# Altium schematic sheet 6V_Supply.SchDoc
size 297 x 209 mm; SheetNumber: 6; SheetTotal: 11
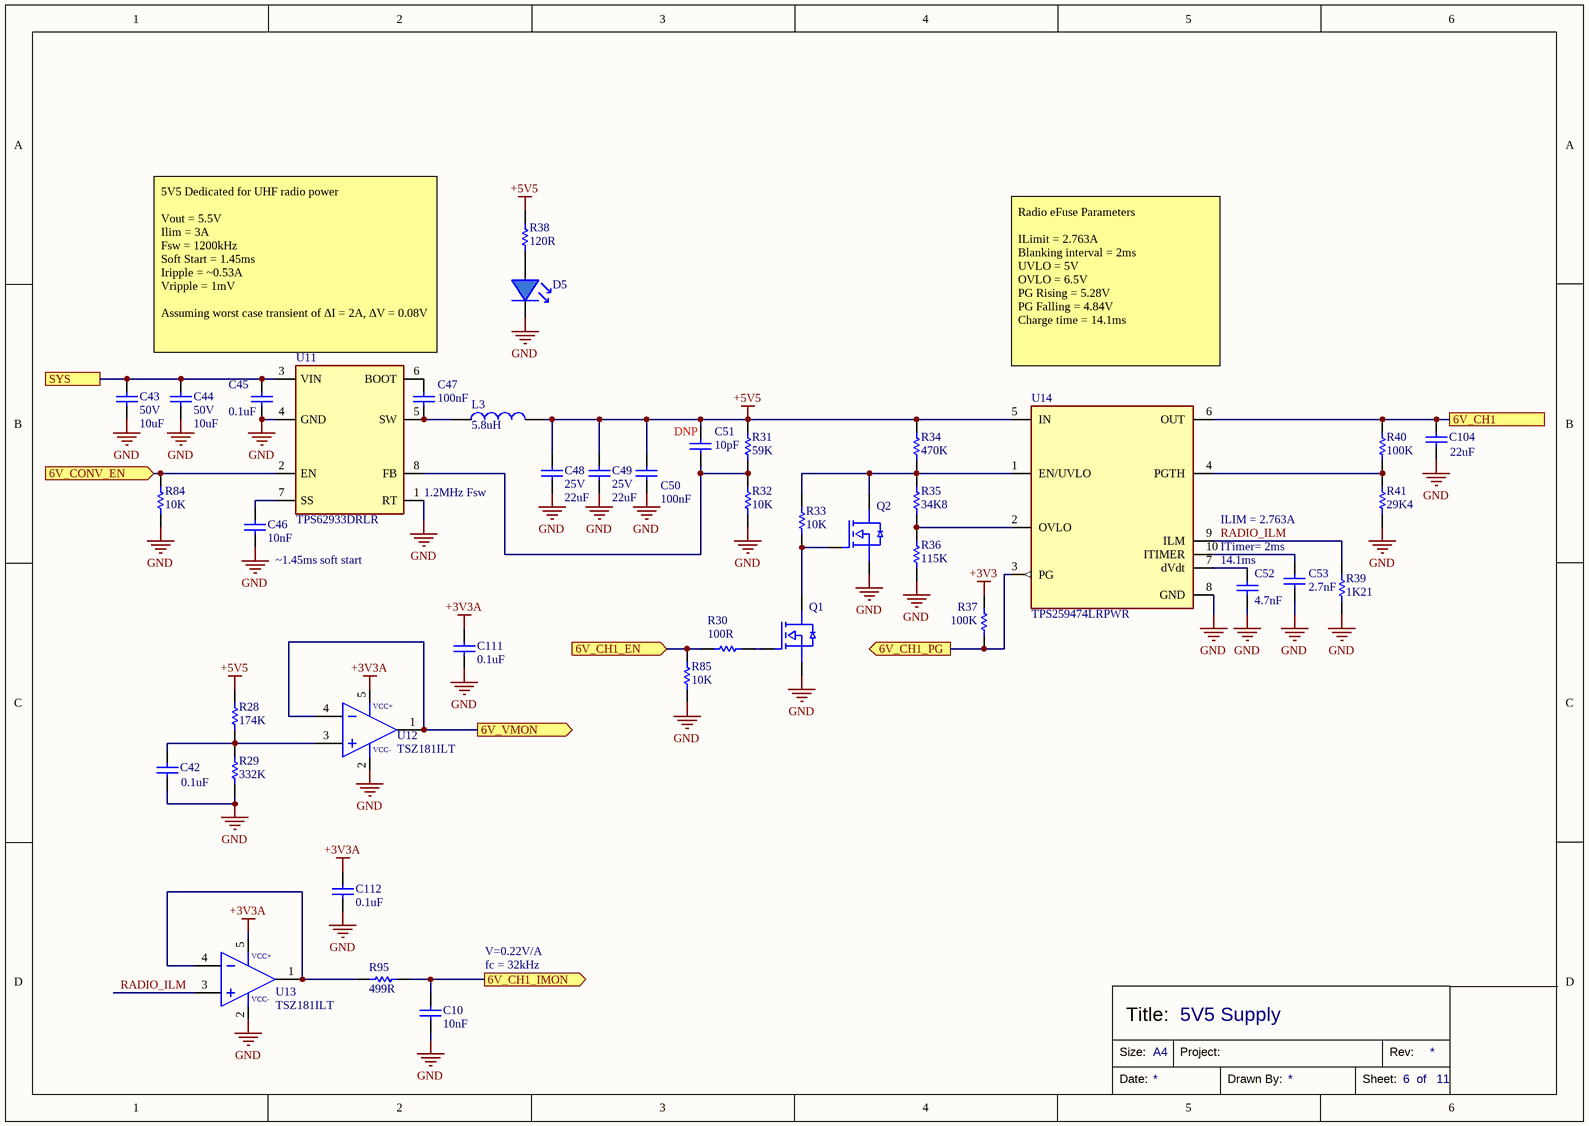
[diagram p0: 6V_Supply.SchDoc]

## Parts
C10  Capacitance: 10nF  [CAPC0805X060]  (hidden comment: CL21B103KBANNNC)
C42  Capacitance: 0.1uF  [CAPC0805X060]  (hidden comment: CL21B104KACNNNC)
C43  Voltage Rating: 50V  Capacitance: 10uF  [CAPC1210X090]  (hidden comment: CL32B106KBJNNNE)
C44  Voltage Rating: 50V  Capacitance: 10uF  [CAPC1210X090]  (hidden comment: CL32B106KBJNNNE)
C45  Capacitance: 0.1uF  [CAPC0402X020]  (hidden comment: CL05B104KB5NNNC)
C46  Capacitance: 10nF  [CAPC0805X060]  (hidden comment: CL21B103KBANNNC)
C47  Capacitance: 100nF  [CAPC0603X040]  (hidden comment: C0603C104K5RACTU)
C48  Voltage Rating: 25V  Capacitance: 22uF  [CAPC1210X090]  (hidden comment: CL32B226KAJNNNE)
C49  Voltage Rating: 25V  Capacitance: 22uF  [CAPC1210X090]  (hidden comment: CL32B226KAJNNNE)
C50  Capacitance: 100nF  [CAPC0603X040]  (hidden comment: C0603C104K5RACTU)
C51  Capacitance: 10pF  [CAPC0603X040]  (hidden comment: C0603C104K5RACTU)
C52  Capacitance: 4.7nF  [CAPC0805X060]  (hidden comment: CL21B105KAFNNNE)
C53  Capacitance: 2.7nF  [CAPC0805X060]  (hidden comment: GRM2165C1H272JA01D)
C104  Capacitance: 22uF  [CAPC1210X090]  (hidden comment: CL32B226MOJNNNE)
C111  Capacitance: 0.1uF  [CAPC0603X040]  (hidden comment: C0603C104K5RACTU)
C112  Capacitance: 0.1uF  [CAPC0603X040]  (hidden comment: C0603C104K5RACTU)
D5  LSM0805463V  [LEDB_0805]  (value not drawn)
L3  744316560  [744316560]  (value not drawn)
Q1  T2N7002AK,LM  [SOT23-3 MOSFET]  (value not drawn)
Q2  T2N7002AK,LM  [SOT23-3 MOSFET]  (value not drawn)
R28  Resistance: 174K  [RESC0603]  (hidden comment: RMCF0603FT174K)
R29  Resistance: 332K  [RESC0805]  (hidden comment: RMCF0805FT332K)
R30  Resistance: 100R  [RESC0805]  (hidden comment: RMCF0805FT100R)
R31  Resistance: 59K  [RESC0603]  (hidden comment: RMCF0603FT59K0)
R32  Resistance: 10K  [RESC0603]  (hidden comment: RMCF0603FT10K0)
R33  Resistance: 10K  [RESC0805]  (hidden comment: RMCF0805FT10K0)
R34  Resistance: 470K  [RESC0603]  (hidden comment: RMCF0603FT470K)
R35  Resistance: 34K8  [RESC0805]  (hidden comment: RMCF0805FT34K8)
R36  Resistance: 115K  [RESC0805]  (hidden comment: RMCF0805FT115K)
R37  Resistance: 100K  [RESC0805]  (hidden comment: RMCF0805FG100K)
R38  Resistance: 120R  [RESC0805]  (hidden comment: RMCF0805FT120R)
R39  Resistance: 1K21  [RESC0805]  (hidden comment: RMCF0805FT1K21)
R40  Resistance: 100K  [RESC0805]  (hidden comment: RMCF0805FG100K)
R41  Resistance: 29K4  [RESC0805]  (hidden comment: RMCF0805FT29K4)
R84  Resistance: 10K  [RESC0805]  (hidden comment: RMCF0805FT10K0)
R85  Resistance: 10K  [RESC0805]  (hidden comment: RMCF0805FT10K0)
R95  Resistance: 499R  [RESC0805]  (hidden comment: RMCF0805FT499R)
U11  TPS62933DRLR  [SOT-583]
U12  TSZ181ILT  [SOT23-5 IC]
U13  TSZ181ILT  [SOT23-5 IC]
U14  TPS259474LRPWR  [VFQFN-10]

## Ports
6V_CH1 (see PDM[6B], PC104[4C], PC104[5C]), 6V_CH1_EN (in, see PDM[5C], Controller[3C]), 6V_CH1_IMON (out, see PDM[5C], Controller[1B]), 6V_CH1_PG (out, see PDM[5C], Controller[3C]), 6V_CONV_EN (in, see PDM[5C], Controller[3B]), 6V_VMON (out, see PDM[5C], Controller[1B]), SYS (see PDM[5B], 3V3_Supply[1B], 5V_Supply[1A], 12V_Supply[1A], PC104[4C], PC104[5C])

## Nets
+3V3: R37.2
+3V3A: C111.2 C112.2 U12.5(VCC+) U13.5(VCC+)
+5V5: C48.2 C49.2 C50.2 C51.2 L3.2 R28.2 R31.2 R34.2 R38.2 U14.5(IN)
GND: C10.1 C42.1 C43.1 C44.1 C45.1 C46.1 C48.1 C49.1 C50.1 C52.1 C53.1 C104.1 C111.1 C112.1 D5.K Q1.S Q2.S R29.1 R32.1 R36.1 R39.1 R41.1 R84.1 R85.1 U11.1(RT) U11.4(GND) U12.2(VCC-) U13.2(VCC-) U14.8(GND)
6V_CH1: C104.2 R40.2 U14.6(OUT) ; port 6V_CH1
6V_CH1_EN: R30.2 R85.2 ; port 6V_CH1_EN
6V_CH1_IMON: C10.2 R95.2 ; port 6V_CH1_IMON
6V_CH1_PG: R37.1 U14.3(PG) ; port 6V_CH1_PG
6V_CONV_EN: R84.2 U11.2(EN) ; port 6V_CONV_EN
6V_VMON: U12.1(OUT) U12.4(IN-) ; port 6V_VMON
RADIO_ILM: R39.2 U13.3(IN+) U14.9(ILM)
SYS: C43.2 C44.2 C45.2 U11.3(VIN) ; port SYS
NetC42_2: C42.2 R28.1 R29.2 U12.3(IN+)
NetC46_2: C46.2 U11.7(SS)
NetC47_1: C47.1 L3.1 U11.5(SW)
NetC47_2: C47.2 U11.6(BOOT)
NetC51_1: C51.1 R31.1 R32.2 U11.8(FB)
NetC52_2: C52.2 U14.7(dVdt)
NetC53_2: C53.2 U14.10(ITIMER)
NetD5_A: D5.A R38.1
NetQ1_D: Q1.D Q2.G R33.1
NetQ1_G: Q1.G R30.1
NetQ2_D: Q2.D R33.2 R34.1 R35.2 U14.1(EN/UVLO)
NetR35_1: R35.1 R36.2 U14.2(OVLO)
NetR40_1: R40.1 R41.2 U14.4(PGTH)
NetR95_1: R95.1 U13.1(OUT) U13.4(IN-)

## Notes on the sheet
- 5V5 Dedicated for UHF radio power
  Vout = 5.5V
  Ilim = 3A
  Fsw = 1200kHz
  Soft Start = 1.45ms
  Iripple = ~0.53A
  Vripple = 1mV
  Assuming worst case transient of ΔI = 2A, ΔV = 0.08V
- Radio eFuse Parameters
  ILimit = 2.763A
  Blanking interval = 2ms
  UVLO = 5V
  OVLO = 6.5V
  PG Rising = 5.28V
  PG Falling = 4.84V
  Charge time = 14.1ms
- (near L3) 5.8uH
- (near C51) DNP
- (near U11) 1.2MHz Fsw
- (near U14) ILIM = 2.763A
- (near C46) ~1.45ms soft start
- ITimer= 2ms
- (near C52) 14.1ms
- V=0.22V/A
- fc = 32kHz
- 5V5 Supply
- Size:
- Title:
- A4
- Project:
- Rev:
- Date:
- Drawn By:
- Sheet:
- of

## Library data of the parts
C10 C46 = CL21B103KBANNNC: 10nF ±10% 50V Ceramic Capacitor X7R 0805 (2012 Metric); Voltage Rating: 25V; Part Number: CL21B103KBANNNC; Distributor Part Number: 1276-1015-1-ND; Tolerance: 10%; Case Code: 0805; Distributor: Digikey
C42 = CL21B104KACNNNC: 0.1uF ±10% 25V Ceramic Capacitor X7R 0805 (2012 Metric); Part Number: CL21B104KACNNNC; Distributor Part Number: 1276-1099-1-ND; Tolerance: 10%; Case Code: 0805; Distributor: Digikey; Voltage Rating: 25V
C43 C44 = CL32B106KBJNNNE: 10 µF ±10% 50V Ceramic Capacitor X7R 1210 (3225 Metric); Manufacturer Part Number: CL32B106KBJNNNE; Distributor Part Number: 1276-3387-1-ND; Tolerance: 10%; Case Code: 1210; Distributor: Digikey
C45 = CL05B104KB5NNNC: 0.1 µF ±10% 50V Ceramic Capacitor X7R 0402 (1005 Metric); Part Number: CL05B104KB5NNNC; Tolerance: 10%; Distributor Part Number: 1276-CL05B104KB5NNNCCT-ND; Case Code: 0402; Distributor: Digikey; Voltage Rating: 50V
C47 C50 C111 C112 = C0603C104K5RACTU: 0.1 µF ±10% 50V Ceramic Capacitor X7R 0603 (1608 Metric); Distributor Part Number: 399-C0603C104K5RACTUCT-ND; Tolerance: 10%; Case Code: 0603; Distributor: Digikey; Voltage Rating: 50V
  C47: Manufacturer Part Number: C0603C104K5RACTU
  C50 C111 C112: Part Number: C0603C104K5RACTU
C48 C49 = CL32B226KAJNNNE: 22 µF ±10% 25V Ceramic Capacitor X7R 1210 (3225 Metric); Part Number: CL32B226KAJNNNE; Distributor Part Number: 1276-3392-1-ND; Tolerance: 10%; Case Code: 1210; Distributor: Digikey
C51 = C0603C100J5GACTU: 10 pF ±5% 50V Ceramic Capacitor C0G, NP0 0603 (1608 Metric); Tolerance: 10%; Part Number: C0603C100J5GACTU; Distributor Part Number: 399-C0603C100J5GACTUCT-ND; Case Code: 0603; Distributor: Digikey; Voltage Rating: 50V
C52 = CL21B472KBANNNC: 4.7nF ±10% 50V Ceramic Capacitor X7R 0805 (2012 Metric); Voltage Rating: 25V; Part Number: CL21B472KBANNNC; Distributor Part Number: 1276-1155-1-ND; Tolerance: 10%; Case Code: 0805; Distributor: Digikey
C53 = GRM2165C1H272JA01D: 2.7nF ±5% 50V Ceramic Capacitor C0G, NP0 0805 (2012 Metric); Manufacturer Part Number: GRM2165C1H272JA01D; Distributor Part Number: 490-1630-1-ND; Tolerance: 5%; Case Code: 0805; Distributor: Digikey; Voltage Rating: 50V
C104 = CL32B226MOJNNNE: 22 µF ±20% 16V Ceramic Capacitor X7R 1210 (3225 Metric); Tolerance: 10%; Voltage Rating: 50V; Part Number: CL32B226MOJNNNE; Distributor Part Number: 1276-3395-1-ND; Case Code: 1210; Distributor: Digikey
D5 = LEDB0805: Blue 469nm LED Indication - Discrete 3V 0805 (2012 Metric); Manufacturer Part Number: LSM0805463V; Distributor Part Number: 28-LSM0805463VCT-ND; Colour: Blue; Operating Temperature: *; Voltage - Forward: 3V; Distributor: Digikey
L3 = 744316560: Inductor 5.6uH 4.5A Shielded 28.5mOhm SMD; Saturation Current: 4.6A; Part Number: 744316560; Distributor Part Number: 732-6183-1-ND; Distributor: Digikey; Current Rating: 4.5A; DCR: 28.5mOhm
Q1 Q2 = T2N7002AK,LM: N-Channel 60 V 200mA (Ta) 320mW (Ta) Surface Mount SOT-23-3; Drain to Source Voltage: 60V; Rds On (Max) @ Id, Vgs: 3.9ohm; Vgs(th) (Max) @ Id: 2.1V @ 250µA; (Id) @ 25°C: 200mA; Vgs (Max): *; Power Dissipation (Max): 320mW (Ta); Operating Temperature: -55C - 150C; Manufacturer Part Number: T2N7002AK,LM; Part Number: T2N7002AK,LM; Distributor: Digikey; Distributor Part Number: T2N7002AKLMCT-ND
R28 = RMCF0603FT174K: 174 kOhms ±1% 0.1W, 1/10W Chip Resistor 0603 (1608 Metric) Automotive AEC-Q200 Thick Film; Manufacturer Part Number: RMCF0603FT174K; Tolerance: 1%; Distributor: Digikey; Distributor Part Number: RMCF0603FT174KCT-ND; Case Code: 0603
R29 = RMCF0805FT332K: 332 kOhms ±1% 0.125W, 1/8W Chip Resistor 0805 (2012 Metric) Automotive AEC-Q200 Thick Film; Part Number: RMCF0805FT332K; Tolerance: 1%; Distributor Part Number: RMCF0805FT332KCT-ND; Distributor: Digikey; Case Code: 0805
R30 = RMCF0805FT100R: 100 Ohms ±1% 0.125W, 1/8W Chip Resistor 0805 (2012 Metric) Automotive AEC-Q200 Thick Film; Part Number: RMCF0805FT100R; Tolerance: 1%; Distributor Part Number: RMCF0805FT100RCT-ND; Distributor: Digikey; Case Code: 0805
R31 = RMCF0603FT59K0: 59 kOhms ±1% 0.1W, 1/10W Chip Resistor 0603 (1608 Metric) Automotive AEC-Q200 Thick Film; Part Number: RMCF0603FT59K0; Tolerance: 1%; Distributor Part Number: RMCF0603FT59K0CT-ND; Distributor: Digikey; Case Code: 0603
R32 = RMCF0603FT10K0: 10 kOhms ±1% 0.1W, 1/10W Chip Resistor 0603 (1608 Metric) Automotive AEC-Q200 Thick Film; Tolerance: 1%; Distributor Part Number: RMCF0603FT10K0CT-ND; Distributor: Digikey; Case Code: 0603; Part Number: RMCF0603FT10K0
R33 R84 R85 = RMCF0805FT10K0: 10 kOhms ±1% 0.125W, 1/8W Chip Resistor 0805 (2012 Metric) Automotive AEC-Q200 Thick Film; Part Number: RMCF0805FT10K0; Tolerance: 1%; Distributor Part Number: RMCF0805FT10K0CT-ND; Distributor: Digikey; Case Code: 0805
R34 = RMCF0603FT470K: 470 kOhms ±1% 0.1W, 1/10W Chip Resistor 0603 (1608 Metric) Automotive AEC-Q200 Thick Film; Part Number: RMCF0603FT470K; Tolerance: 1%; Distributor: Digikey; Distributor Part Number: RMCF0603FT470KCT-ND; Case Code: 0603
R35 = RMCF0805FT34K8: 34.8 kOhms ±1% 0.125W, 1/8W Chip Resistor 0805 (2012 Metric) Automotive AEC-Q200 Thick Film; Part Number: RMCF0805FT34K8; Tolerance: 1%; Distributor Part Number: RMCF0805FT34K8CT-ND; Distributor: Digikey; Case Code: 0805
R36 = RMCF0805FT115K: 115 kOhms ±1% 0.125W, 1/8W Chip Resistor 0805 (2012 Metric) Automotive AEC-Q200 Thick Film; Part Number: RMCF0805FT115K; Tolerance: 1%; Distributor Part Number: RMCF0805FT115KCT-ND; Distributor: Digikey; Case Code: 0805
R37 R40 = RMCF0805FG100K: 100 kOhms ±1% 0.125W, 1/8W Chip Resistor 0805 (2012 Metric) Automotive AEC-Q200 Thick Film; Part Number: RMCF0805FG100K; Tolerance: 1%; Distributor Part Number: RMCF0805FG100KCT-ND; Distributor: Digikey; Case Code: 0805
R38 = RMCF0805FT120R: 120 Ohms ±1% 0.125W, 1/8W Chip Resistor 0805 (2012 Metric) Automotive AEC-Q200 Thick Film; Part Number: RMCF0805FT120R; Tolerance: 1%; Distributor Part Number: 738-RMCF0805FT120RCT-ND; Distributor: Digikey; Case Code: 0805
R39 = RMCF0805FT1K21: 1.21 kOhms ±1% 0.125W, 1/8W Chip Resistor 0805 (2012 Metric) Automotive AEC-Q200 Thick Film; Part Number: RMCF0805FT1K21; Tolerance: 1%; Distributor Part Number: RMCF0805FT1K21CT-ND; Distributor: Digikey; Case Code: 0805
R41 = RMCF0805FT29K4: 29.4 kOhms ±1% 0.125W, 1/8W Chip Resistor 0805 (2012 Metric) Automotive AEC-Q200 Thick Film; Part Number: RMCF0805FT29K4; Tolerance: 1%; Distributor Part Number: RMCF0805FT29K4CT-ND; Distributor: Digikey; Case Code: 0805
R95 = RMCF0805FT499R: 499 Ohms ±1% 0.125W, 1/8W Chip Resistor 0805 (2012 Metric) Automotive AEC-Q200 Thick Film; Part Number: RMCF0805FT499R; Tolerance: 1%; Distributor Part Number: RMCF0805FT499RCT-ND; Distributor: Digikey; Case Code: 0805
U11 = TPS62933DRLR: Buck Switching Regulator IC Positive Adjustable 0.8V 1 Output 3A SOT-583; Voltage - Input (Min): 3.8V; Voltage - Input (Max): 30V; Voltage - Output (Max): 22V; Part Number: TPS62933DRLR; Distributor Part Number: 296-TPS62933DRLRCT-ND; Distributor: Digikey; Operating Temperature: -40°C ~ 150°C (TJ); Current Output: 3A; Voltage - Output (Min): 0.8V
U12 U13 = TSZ181ILT: Operational Amplifier, General Purpose, 2.2V~5.5V; Voltage Supply (Min): 2.2V; Voltage Supply (Max): 5.5V; Slew Rate: 4.7V/us; Gain Bandwidth Product: 3MHz; Part Number: TSZ181ILT; Distributor: Digikey; Distributor Part Number: 497-18084-1-ND; Operating Temperature: -40°C ~ 125°C
U14 = TPS259474LRPWR: eFuse 5.5A, 2.7V~23V, 28mOhm, Reverse Current Blocking with Input Reverse Polarity Protection; Part Number: TPS259474LRPWR; Distributor: Digikey; Distributor Part Number: 296-TPS259474LRPWRCT-ND; Operating Temperature: -40°C ~ 125°C; Output Current: 5.5A; Voltage Input: 2.7V~23V